# EasyEDA schematic Sheet_2.json
TITLE: 8 Bit ALU - 1 Bit; REV: 1.0; Date: 2021-12-28; Sheet: 2/3; Drawn By: Koehler, Paul; Company: komed3
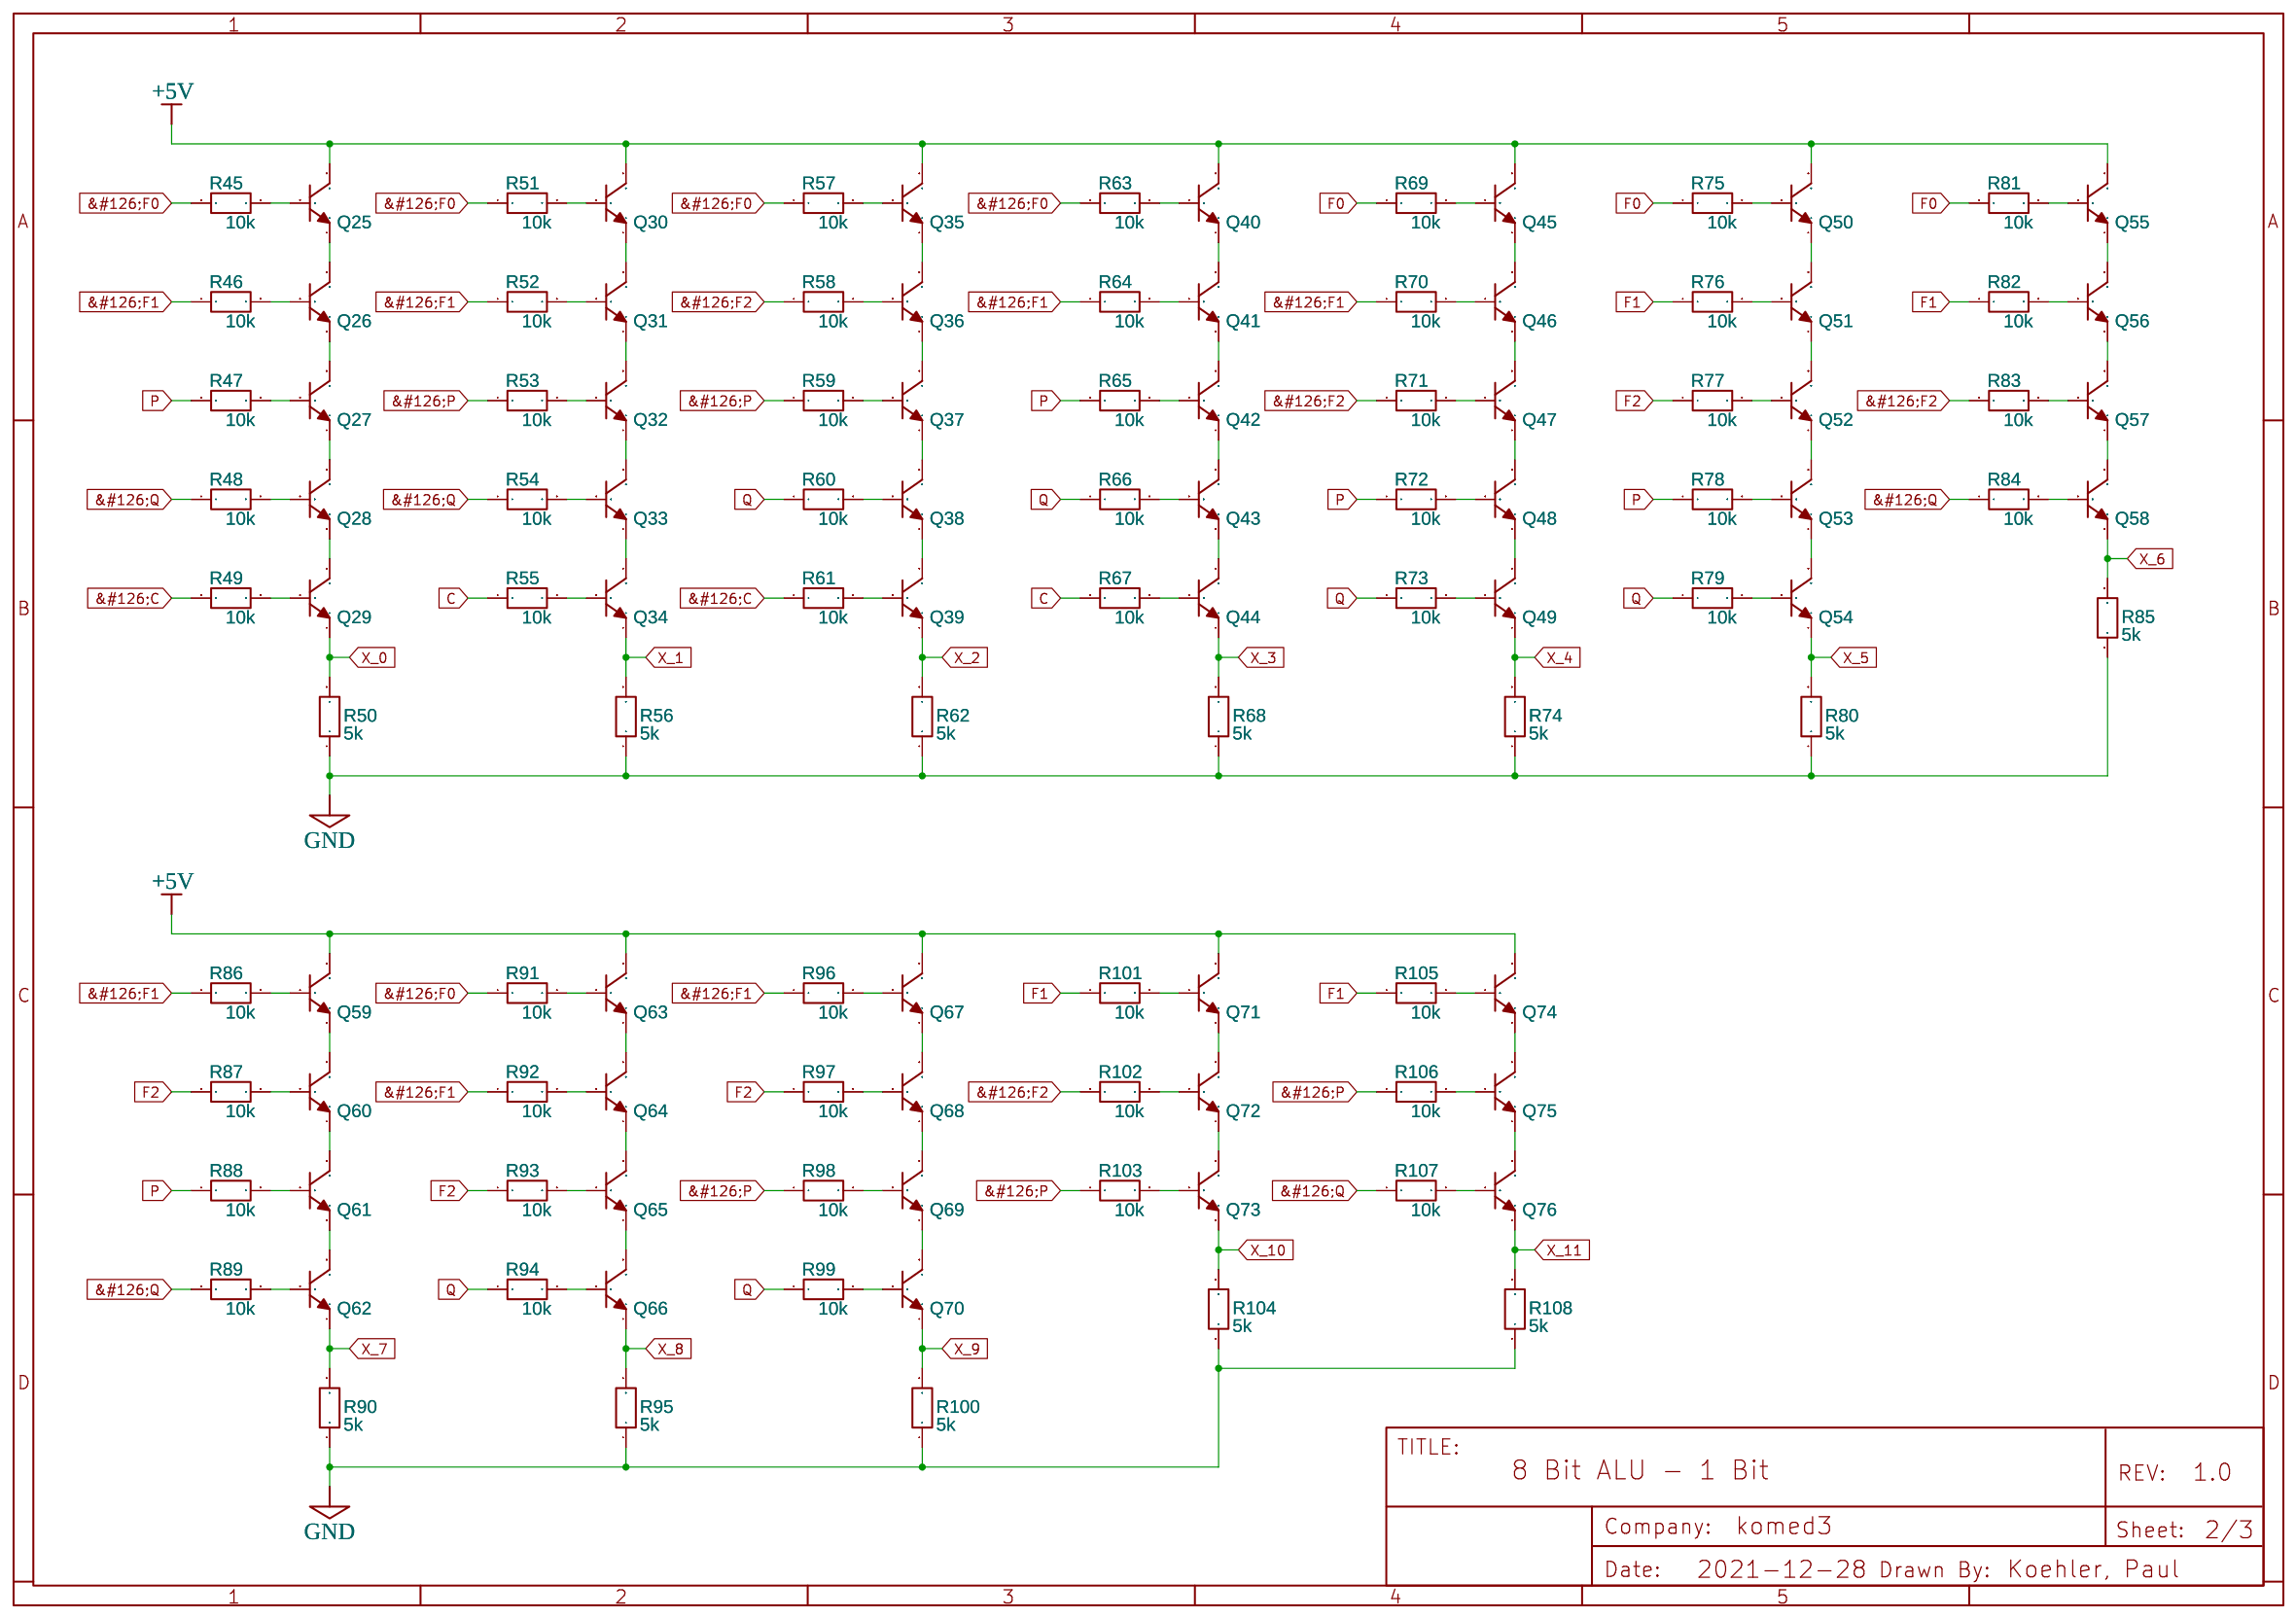
[diagram p0: schematic sheet]

## Parts
Q25  2N3904(TO-92)  [TO-92-3_L5.1-W4.1-P1.27-L]
Q26  2N3904(TO-92)  [TO-92-3_L5.1-W4.1-P1.27-L]
Q27  2N3904(TO-92)  [TO-92-3_L5.1-W4.1-P1.27-L]
Q28  2N3904(TO-92)  [TO-92-3_L5.1-W4.1-P1.27-L]
Q29  2N3904(TO-92)  [TO-92-3_L5.1-W4.1-P1.27-L]
Q30  2N3904(TO-92)  [TO-92-3_L5.1-W4.1-P1.27-L]
Q31  2N3904(TO-92)  [TO-92-3_L5.1-W4.1-P1.27-L]
Q32  2N3904(TO-92)  [TO-92-3_L5.1-W4.1-P1.27-L]
Q33  2N3904(TO-92)  [TO-92-3_L5.1-W4.1-P1.27-L]
Q34  2N3904(TO-92)  [TO-92-3_L5.1-W4.1-P1.27-L]
Q35  2N3904(TO-92)  [TO-92-3_L5.1-W4.1-P1.27-L]
Q36  2N3904(TO-92)  [TO-92-3_L5.1-W4.1-P1.27-L]
Q37  2N3904(TO-92)  [TO-92-3_L5.1-W4.1-P1.27-L]
Q38  2N3904(TO-92)  [TO-92-3_L5.1-W4.1-P1.27-L]
Q39  2N3904(TO-92)  [TO-92-3_L5.1-W4.1-P1.27-L]
Q40  2N3904(TO-92)  [TO-92-3_L5.1-W4.1-P1.27-L]
Q41  2N3904(TO-92)  [TO-92-3_L5.1-W4.1-P1.27-L]
Q42  2N3904(TO-92)  [TO-92-3_L5.1-W4.1-P1.27-L]
Q43  2N3904(TO-92)  [TO-92-3_L5.1-W4.1-P1.27-L]
Q44  2N3904(TO-92)  [TO-92-3_L5.1-W4.1-P1.27-L]
Q45  2N3904(TO-92)  [TO-92-3_L5.1-W4.1-P1.27-L]
Q46  2N3904(TO-92)  [TO-92-3_L5.1-W4.1-P1.27-L]
Q47  2N3904(TO-92)  [TO-92-3_L5.1-W4.1-P1.27-L]
Q48  2N3904(TO-92)  [TO-92-3_L5.1-W4.1-P1.27-L]
Q49  2N3904(TO-92)  [TO-92-3_L5.1-W4.1-P1.27-L]
Q50  2N3904(TO-92)  [TO-92-3_L5.1-W4.1-P1.27-L]
Q51  2N3904(TO-92)  [TO-92-3_L5.1-W4.1-P1.27-L]
Q52  2N3904(TO-92)  [TO-92-3_L5.1-W4.1-P1.27-L]
Q53  2N3904(TO-92)  [TO-92-3_L5.1-W4.1-P1.27-L]
Q54  2N3904(TO-92)  [TO-92-3_L5.1-W4.1-P1.27-L]
Q55  2N3904(TO-92)  [TO-92-3_L5.1-W4.1-P1.27-L]
Q56  2N3904(TO-92)  [TO-92-3_L5.1-W4.1-P1.27-L]
Q57  2N3904(TO-92)  [TO-92-3_L5.1-W4.1-P1.27-L]
Q58  2N3904(TO-92)  [TO-92-3_L5.1-W4.1-P1.27-L]
Q59  2N3904(TO-92)  [TO-92-3_L5.1-W4.1-P1.27-L]
Q60  2N3904(TO-92)  [TO-92-3_L5.1-W4.1-P1.27-L]
Q61  2N3904(TO-92)  [TO-92-3_L5.1-W4.1-P1.27-L]
Q62  2N3904(TO-92)  [TO-92-3_L5.1-W4.1-P1.27-L]
Q63  2N3904(TO-92)  [TO-92-3_L5.1-W4.1-P1.27-L]
Q64  2N3904(TO-92)  [TO-92-3_L5.1-W4.1-P1.27-L]
Q65  2N3904(TO-92)  [TO-92-3_L5.1-W4.1-P1.27-L]
Q66  2N3904(TO-92)  [TO-92-3_L5.1-W4.1-P1.27-L]
Q67  2N3904(TO-92)  [TO-92-3_L5.1-W4.1-P1.27-L]
Q68  2N3904(TO-92)  [TO-92-3_L5.1-W4.1-P1.27-L]
Q69  2N3904(TO-92)  [TO-92-3_L5.1-W4.1-P1.27-L]
Q70  2N3904(TO-92)  [TO-92-3_L5.1-W4.1-P1.27-L]
Q71  2N3904(TO-92)  [TO-92-3_L5.1-W4.1-P1.27-L]
Q72  2N3904(TO-92)  [TO-92-3_L5.1-W4.1-P1.27-L]
Q73  2N3904(TO-92)  [TO-92-3_L5.1-W4.1-P1.27-L]
Q74  2N3904(TO-92)  [TO-92-3_L5.1-W4.1-P1.27-L]
Q75  2N3904(TO-92)  [TO-92-3_L5.1-W4.1-P1.27-L]
Q76  2N3904(TO-92)  [TO-92-3_L5.1-W4.1-P1.27-L]
R45  10k  [RESISTOR-1/2W-VERTICAL]
R46  10k  [RESISTOR-1/2W-VERTICAL]
R47  10k  [RESISTOR-1/2W-VERTICAL]
R48  10k  [RESISTOR-1/2W-VERTICAL]
R49  10k  [RESISTOR-1/2W-VERTICAL]
R50  5k  [RESISTOR-1/2W-VERTICAL]
R51  10k  [RESISTOR-1/2W-VERTICAL]
R52  10k  [RESISTOR-1/2W-VERTICAL]
R53  10k  [RESISTOR-1/2W-VERTICAL]
R54  10k  [RESISTOR-1/2W-VERTICAL]
R55  10k  [RESISTOR-1/2W-VERTICAL]
R56  5k  [RESISTOR-1/2W-VERTICAL]
R57  10k  [RESISTOR-1/2W-VERTICAL]
R58  10k  [RESISTOR-1/2W-VERTICAL]
R59  10k  [RESISTOR-1/2W-VERTICAL]
R60  10k  [RESISTOR-1/2W-VERTICAL]
R61  10k  [RESISTOR-1/2W-VERTICAL]
R62  5k  [RESISTOR-1/2W-VERTICAL]
R63  10k  [RESISTOR-1/2W-VERTICAL]
R64  10k  [RESISTOR-1/2W-VERTICAL]
R65  10k  [RESISTOR-1/2W-VERTICAL]
R66  10k  [RESISTOR-1/2W-VERTICAL]
R67  10k  [RESISTOR-1/2W-VERTICAL]
R68  5k  [RESISTOR-1/2W-VERTICAL]
R69  10k  [RESISTOR-1/2W-VERTICAL]
R70  10k  [RESISTOR-1/2W-VERTICAL]
R71  10k  [RESISTOR-1/2W-VERTICAL]
R72  10k  [RESISTOR-1/2W-VERTICAL]
R73  10k  [RESISTOR-1/2W-VERTICAL]
R74  5k  [RESISTOR-1/2W-VERTICAL]
R75  10k  [RESISTOR-1/2W-VERTICAL]
R76  10k  [RESISTOR-1/2W-VERTICAL]
R77  10k  [RESISTOR-1/2W-VERTICAL]
R78  10k  [RESISTOR-1/2W-VERTICAL]
R79  10k  [RESISTOR-1/2W-VERTICAL]
R80  5k  [RESISTOR-1/2W-VERTICAL]
R81  10k  [RESISTOR-1/2W-VERTICAL]
R82  10k  [RESISTOR-1/2W-VERTICAL]
R83  10k  [RESISTOR-1/2W-VERTICAL]
R84  10k  [RESISTOR-1/2W-VERTICAL]
R85  5k  [RESISTOR-1/2W-VERTICAL]
R86  10k  [RESISTOR-1/2W-VERTICAL]
R87  10k  [RESISTOR-1/2W-VERTICAL]
R88  10k  [RESISTOR-1/2W-VERTICAL]
R89  10k  [RESISTOR-1/2W-VERTICAL]
R90  5k  [RESISTOR-1/2W-VERTICAL]
R91  10k  [RESISTOR-1/2W-VERTICAL]
R92  10k  [RESISTOR-1/2W-VERTICAL]
R93  10k  [RESISTOR-1/2W-VERTICAL]
R94  10k  [RESISTOR-1/2W-VERTICAL]
R95  5k  [RESISTOR-1/2W-VERTICAL]
R96  10k  [RESISTOR-1/2W-VERTICAL]
R97  10k  [RESISTOR-1/2W-VERTICAL]
R98  10k  [RESISTOR-1/2W-VERTICAL]
R99  10k  [RESISTOR-1/2W-VERTICAL]
R100  5k  [RESISTOR-1/2W-VERTICAL]
R101  10k  [RESISTOR-1/2W-VERTICAL]
R102  10k  [RESISTOR-1/2W-VERTICAL]
R103  10k  [RESISTOR-1/2W-VERTICAL]
R104  5k  [RESISTOR-1/2W-VERTICAL]
R105  10k  [RESISTOR-1/2W-VERTICAL]
R106  10k  [RESISTOR-1/2W-VERTICAL]
R107  10k  [RESISTOR-1/2W-VERTICAL]
R108  5k  [RESISTOR-1/2W-VERTICAL]

## Library data of the parts
Q25-Q76 = 2N3904(TO-92): Supplier: LCSC; Manufacturer: SEMTECH; Manufacturer Part: 2N3904; Supplier Part: C118538; Contributor: LCEDA_Lib
R45-R108 = R_AXIAL-0.3_EU: Contributor: LCEDA_Lib

## Nets
+5V: Q25.3(C) Q30.3(C) Q35.3(C) Q40.3(C) Q45.3(C) Q50.3(C) Q55.3(C) Q59.3(C) Q63.3(C) Q67.3(C) Q71.3(C) Q74.3(C)
GND: R50.1 R56.1 R62.1 R68.1 R74.1 R80.1 R85.1 R90.1 R95.1 R100.1 R104.1 R108.1
&#126;C: R49.1 R61.1
&#126;F0: R45.1 R51.1 R57.1 R63.1 R91.1
&#126;F1: R46.1 R52.1 R64.1 R70.1 R86.1 R92.1 R96.1
&#126;F2: R58.1 R71.1 R83.1 R102.1
&#126;P: R53.1 R59.1 R98.1 R103.1 R106.1
&#126;Q: R48.1 R54.1 R84.1 R89.1 R107.1
C: R55.1 R67.1
F0: R69.1 R75.1 R81.1
F1: R76.1 R82.1 R101.1 R105.1
F2: R77.1 R87.1 R93.1 R97.1
P: R47.1 R65.1 R72.1 R78.1 R88.1
Q: R60.1 R66.1 R73.1 R79.1 R94.1 R99.1
X_0: Q29.1(E) R50.2
X_1: Q34.1(E) R56.2
X_2: Q39.1(E) R62.2
X_3: Q44.1(E) R68.2
X_4: Q49.1(E) R74.2
X_5: Q54.1(E) R80.2
X_6: Q58.1(E) R85.2
X_7: Q62.1(E) R90.2
X_8: Q66.1(E) R95.2
X_9: Q70.1(E) R100.2
X_10: Q73.1(E) R104.2
X_11: Q76.1(E) R108.2
Net-(Q25-1): Q25.1(E) Q26.3(C)
Net-(Q25-2): Q25.2(B) R45.2
Net-(Q26-1): Q26.1(E) Q27.3(C)
Net-(Q26-2): Q26.2(B) R46.2
Net-(Q27-1): Q27.1(E) Q28.3(C)
Net-(Q27-2): Q27.2(B) R47.2
Net-(Q28-1): Q28.1(E) Q29.3(C)
Net-(Q28-2): Q28.2(B) R48.2
Net-(Q29-2): Q29.2(B) R49.2
Net-(Q30-1): Q30.1(E) Q31.3(C)
Net-(Q30-2): Q30.2(B) R51.2
Net-(Q31-1): Q31.1(E) Q32.3(C)
Net-(Q31-2): Q31.2(B) R52.2
Net-(Q32-1): Q32.1(E) Q33.3(C)
Net-(Q32-2): Q32.2(B) R53.2
Net-(Q33-1): Q33.1(E) Q34.3(C)
Net-(Q33-2): Q33.2(B) R54.2
Net-(Q34-2): Q34.2(B) R55.2
Net-(Q35-1): Q35.1(E) Q36.3(C)
Net-(Q35-2): Q35.2(B) R57.2
Net-(Q36-1): Q36.1(E) Q37.3(C)
Net-(Q36-2): Q36.2(B) R58.2
Net-(Q37-1): Q37.1(E) Q38.3(C)
Net-(Q37-2): Q37.2(B) R59.2
Net-(Q38-1): Q38.1(E) Q39.3(C)
Net-(Q38-2): Q38.2(B) R60.2
Net-(Q39-2): Q39.2(B) R61.2
Net-(Q40-1): Q40.1(E) Q41.3(C)
Net-(Q40-2): Q40.2(B) R63.2
Net-(Q41-1): Q41.1(E) Q42.3(C)
Net-(Q41-2): Q41.2(B) R64.2
Net-(Q42-1): Q42.1(E) Q43.3(C)
Net-(Q42-2): Q42.2(B) R65.2
Net-(Q43-1): Q43.1(E) Q44.3(C)
Net-(Q43-2): Q43.2(B) R66.2
Net-(Q44-2): Q44.2(B) R67.2
Net-(Q45-1): Q45.1(E) Q46.3(C)
Net-(Q45-2): Q45.2(B) R69.2
Net-(Q46-1): Q46.1(E) Q47.3(C)
Net-(Q46-2): Q46.2(B) R70.2
Net-(Q47-1): Q47.1(E) Q48.3(C)
Net-(Q47-2): Q47.2(B) R71.2
Net-(Q48-1): Q48.1(E) Q49.3(C)
Net-(Q48-2): Q48.2(B) R72.2
Net-(Q49-2): Q49.2(B) R73.2
Net-(Q50-1): Q50.1(E) Q51.3(C)
Net-(Q50-2): Q50.2(B) R75.2
Net-(Q51-1): Q51.1(E) Q52.3(C)
Net-(Q51-2): Q51.2(B) R76.2
Net-(Q52-1): Q52.1(E) Q53.3(C)
Net-(Q52-2): Q52.2(B) R77.2
Net-(Q53-1): Q53.1(E) Q54.3(C)
Net-(Q53-2): Q53.2(B) R78.2
Net-(Q54-2): Q54.2(B) R79.2
Net-(Q55-1): Q55.1(E) Q56.3(C)
Net-(Q55-2): Q55.2(B) R81.2
Net-(Q56-1): Q56.1(E) Q57.3(C)
Net-(Q56-2): Q56.2(B) R82.2
Net-(Q57-1): Q57.1(E) Q58.3(C)
Net-(Q57-2): Q57.2(B) R83.2
Net-(Q58-2): Q58.2(B) R84.2
Net-(Q59-1): Q59.1(E) Q60.3(C)
Net-(Q59-2): Q59.2(B) R86.2
Net-(Q60-1): Q60.1(E) Q61.3(C)
Net-(Q60-2): Q60.2(B) R87.2
Net-(Q61-1): Q61.1(E) Q62.3(C)
Net-(Q61-2): Q61.2(B) R88.2
Net-(Q62-2): Q62.2(B) R89.2
Net-(Q63-1): Q63.1(E) Q64.3(C)
Net-(Q63-2): Q63.2(B) R91.2
Net-(Q64-1): Q64.1(E) Q65.3(C)
Net-(Q64-2): Q64.2(B) R92.2
Net-(Q65-1): Q65.1(E) Q66.3(C)
Net-(Q65-2): Q65.2(B) R93.2
Net-(Q66-2): Q66.2(B) R94.2
Net-(Q67-1): Q67.1(E) Q68.3(C)
Net-(Q67-2): Q67.2(B) R96.2
Net-(Q68-1): Q68.1(E) Q69.3(C)
Net-(Q68-2): Q68.2(B) R97.2
Net-(Q69-1): Q69.1(E) Q70.3(C)
Net-(Q69-2): Q69.2(B) R98.2
Net-(Q70-2): Q70.2(B) R99.2
Net-(Q71-1): Q71.1(E) Q72.3(C)
Net-(Q71-2): Q71.2(B) R101.2
Net-(Q72-1): Q72.1(E) Q73.3(C)
Net-(Q72-2): Q72.2(B) R102.2
Net-(Q73-2): Q73.2(B) R103.2
Net-(Q74-1): Q74.1(E) Q75.3(C)
Net-(Q74-2): Q74.2(B) R105.2
Net-(Q75-1): Q75.1(E) Q76.3(C)
Net-(Q75-2): Q75.2(B) R106.2
Net-(Q76-2): Q76.2(B) R107.2
